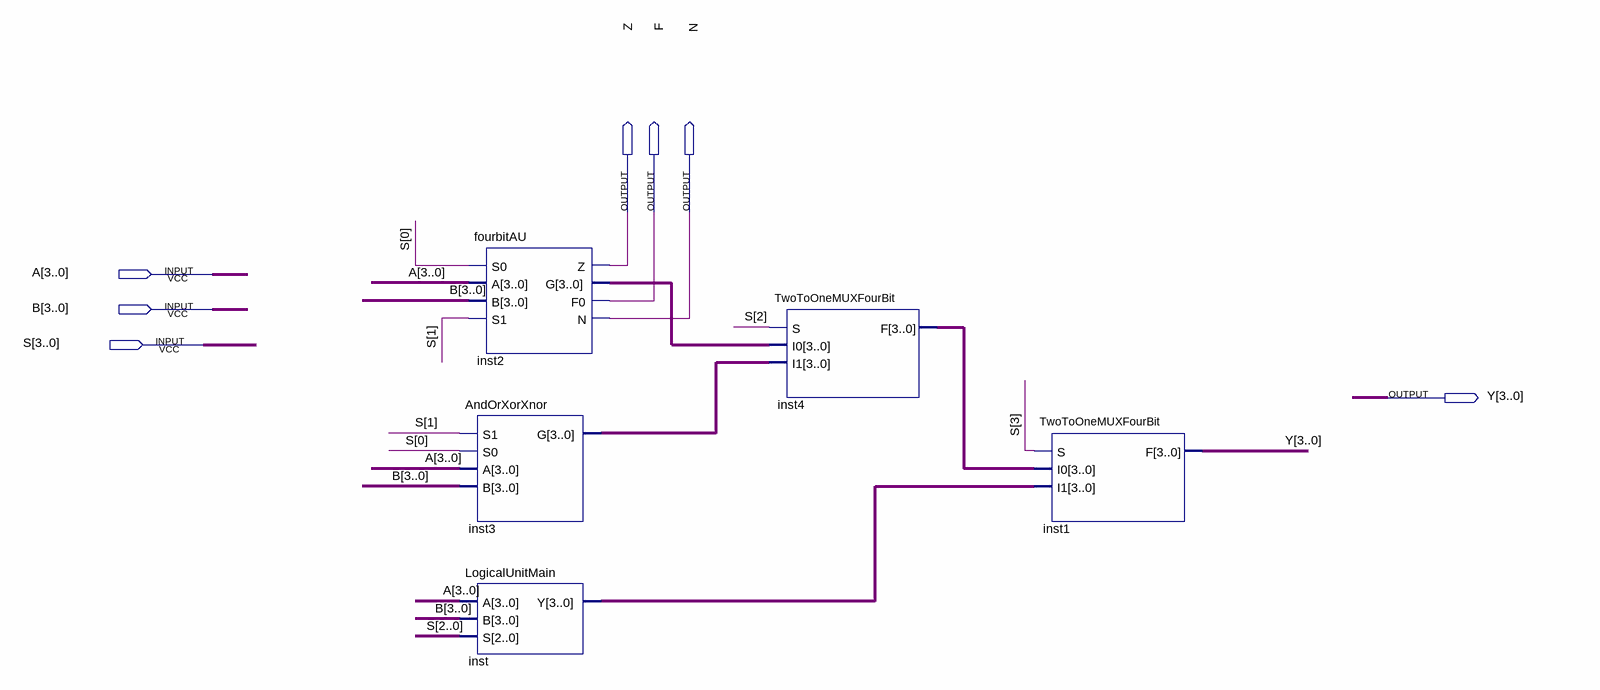
[diagram p0: schematic sheet]
// Quartus schematic MainALU.bdf as structural Verilog: 5 symbols, 7 pins
module MainALU (
  input  [3:0] A,
  input  [3:0] B,
  input  [3:0] S,
  output Z,
  output F,
  output N,
  output [3:0] Y
);

  wire [3:0] inst2_g, inst3_g, inst4_f, inst_y;

  fourbitAU inst2 (.S0(S[0]), .A(A), .B(B), .S1(S[1]), .Z(Z), .G(inst2_g), .F0(F), .N(N));
  AndOrXorXnor inst3 (.S1(S[1]), .S0(S[0]), .A(A), .B(B), .G(inst3_g));
  LogicalUnitMain inst (.A(A), .B(B), .S(S[2:0]), .Y(inst_y));
  TwoToOneMUXFourBit inst4 (.S(S[2]), .I0(inst2_g), .I1(inst3_g), .F(inst4_f));
  TwoToOneMUXFourBit inst1 (.S(S[3]), .I0(inst4_f), .I1(inst_y), .F(Y));
endmodule
